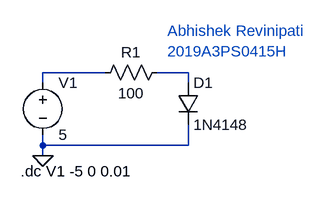
[diagram p0: schematic 2019A3PS0415H_diode_rev.asc]
2019A3PS0415H_diode_rev.asc, the LTspice schematic file:
Version 4
SHEET 1 880 680
WIRE 176 112 80 112
WIRE 304 112 256 112
WIRE 80 128 80 112
WIRE 304 128 304 112
WIRE 80 224 80 208
WIRE 304 224 304 192
WIRE 304 224 80 224
WIRE 80 240 80 224
FLAG 80 240 0
SYMBOL voltage 80 112 R0
WINDOW 123 0 0 Left 0
WINDOW 39 0 0 Left 0
SYMATTR InstName V1
SYMATTR Value 5
SYMBOL res 272 96 R90
WINDOW 0 0 56 VBottom 2
WINDOW 3 32 56 VTop 2
SYMATTR InstName R1
SYMATTR Value 100
SYMBOL diode 288 128 R0
SYMATTR InstName D1
SYMATTR Value 1N4148
TEXT 46 264 Left 2 !.dc V1 -5 0 0.01
TEXT 272 48 Left 2 ;Abhishek Revinipati\n2019A3PS0415H

The netlist it stands for:
* 2019A3PS0415H_diode_rev.asc
V1 N001 0 5
R1 N002 N001 100
D1 N002 0 1N4148
.model D D
.lib standard.dio
.dc V1 -5 0 0.01
* Abhishek Revinipati
* 2019A3PS0415H
.backanno
.end